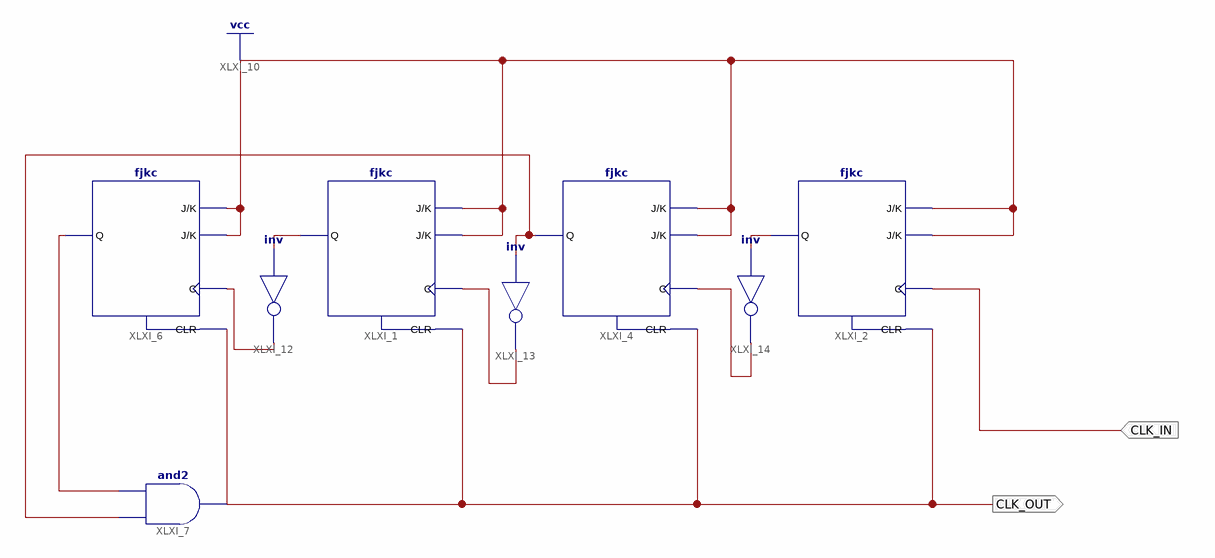
[diagram p0: schematic sheet 1]
// Xilinx ISE schematic Mod10Pulse.sch (spartan6) as structural Verilog: 8 symbols, 2 ports
module Mod10Pulse (
  input  CLK_IN,
  output CLK_OUT
);

  wire XLXN_14, XLXN_40, XLXN_46, XLXN_47, XLXN_48, XLXN_49, XLXN_50;

  fjkc XLXI_1 (.C(XLXN_48), .CLR(CLK_OUT), .J(1'b1), .K(1'b1), .Q(XLXN_46));
  fjkc XLXI_2 (.C(CLK_IN), .CLR(CLK_OUT), .J(1'b1), .K(1'b1), .Q(XLXN_49));
  fjkc XLXI_6 (.C(XLXN_47), .CLR(CLK_OUT), .J(1'b1), .K(1'b1), .Q(XLXN_14));
  fjkc XLXI_4 (.C(XLXN_50), .CLR(CLK_OUT), .J(1'b1), .K(1'b1), .Q(XLXN_40));
  and XLXI_7 (CLK_OUT, XLXN_40, XLXN_14);
  not XLXI_12 (XLXN_47, XLXN_46);
  not XLXI_13 (XLXN_48, XLXN_40);
  not XLXI_14 (XLXN_50, XLXN_49);
endmodule
